# Altium schematic sheet CAN_Transceiver_3V3.SchDoc
size A4; DocumentNumber: 2; SheetNumber: 2; SheetTotal: 11
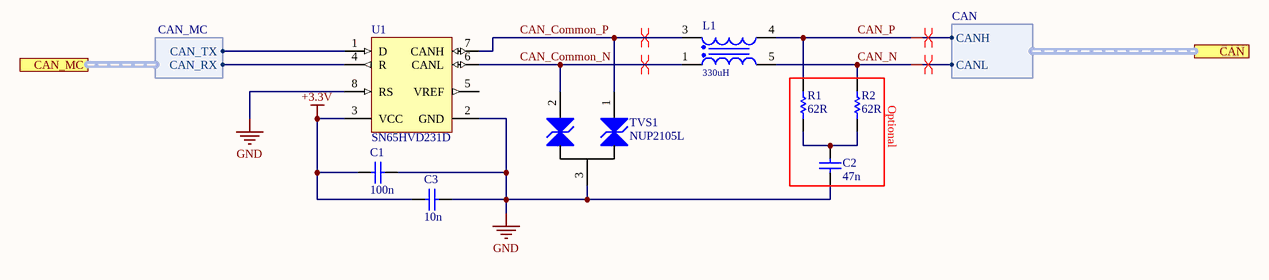
[diagram p0: CAN_Transceiver_3V3.SchDoc]

## Parts
C1  100n  [CAPC0603(1608)55_N]
C2  47n  [CAPC0603(1608)55_N]
C3  10n  [CAPC0603(1608)55_N]
L1  330uH  [WE-SL1]
R1  62R  [RESC0603(1608)_N]
R2  62R  [RESC0603(1608)_N]
TVS1  NUP2105L  [_SOT23-3N]
U1  SN65HVD231D  [D0008A_L]

## Ports
CAN (harness CAN), CAN_MC (harness CAN_MC)

## Harnesses
CAN_MC: CAN_RX, CAN_TX
CAN: CANH, CANL

## Nets
+3.3V: C1.1 C3.1 U1.3(VCC)
GND: C1.2 C2.1 C3.2 TVS1.3(A3) U1.2(GND) U1.8(RS)
CAN_Common_N: L1.1 TVS1.2(A2) U1.6(CANL)
CAN_Common_P: L1.3 TVS1.1(A1) U1.7(CANH)
CAN_N: L1.5 R2.2 ; port CAN.CANL
CAN_P: L1.4 R1.2 ; port CAN.CANH
NetC2_2: C2.2 R1.1 R2.1
NetU1_1: U1.1(D) ; port CAN_MC.CAN_TX
NetU1_4: U1.4(R) ; port CAN_MC.CAN_RX

Not connected (* = marked no-connect by the designer): U1 5(VREF)

## Layout directives
differential pair: CAN_Common_N, CAN_Common_P, CAN_N, CAN_P

## Notes on the sheet
- (near R2) Optional

## Library data of the parts
C1 = Cap 100n: Keramikvielschichtkondensator, SMD, Baureihe MC, ± 10%; Manufacturer: TDK; Voltage Rating: 50V; OC_MOUSER: CGA3E2X7R1H104K080AA; Value: 100n; PackageReference: 0603; Tolerance: ± 10%
C2 = Cap 47n: Keramikvielschichtkondensator, SMD, Baureihe MC, ± 10%; Manufacturer: TDK; Voltage Rating: 50V; OC_MOUSER: CGA3E2X7R1H473K080AA; Value: 47n; PackageReference: 0603; Tolerance: ± 10%
C3 = Cap 10n: Keramikvielschichtkondensator, SMD, Baureihe MC, ± 10%; Manufacturer: TDK; Voltage Rating: 50V; OC_MOUSER: CGA3E2X7R1H103K080AA; Value: 10n; PackageReference: 0603; Tolerance: ± 10%
L1 = 744212331: WE-SL1 SMT Common Mode Line Filter, 330uH, 300mA, 80V; Manufacturer: Wurth Elektronik; Impedance max.: 2000Ohm; Insulation Test Voltage: 250VAC; Winding Style: sectional; ComponentLink1Description: Manufacturer; ComponentLink1URL: http://www.we-online.de; ComponentLink2Description: Datasheet; ComponentLink2URL: https://www.we-online.com/catalog/datasheet/744212331.pdf; Published Date: April 2020; Rated Current: 300mA; Rated Voltage: 80V; Inductance: 330uH; Operating Temperature: -40 to +105degC; Mounting Technology: SMT; Packaging: Tape and Reel; Manufacturer Part Number: 744212331
R1 R2 = Res 62R: Chipwiderstand, SMD, Baureihe MC, 1%; Manufacturer: Multicomp; Power: 100mW; PackageReference: 0603; Value: 62R; OC_FARNELL: 9331433
TVS1 = NUP2105L: Dual Bidirectional Voltage Suppressor 350W Peak
U1 = CMP-0315-00079-2: 3.3V CAN Transceiver with Sleep Mode, 17 mA, 3.3 V, -40 to 85 degC, 8-pin SOIC (D), Green (RoHS & no Sb/Br); Manufacturer: Texas Instruments; Drivers Per Package: 1; Rating: Catalog; Transient Pulse Protection(V): -25 to 25; Supply Voltage(s)(V): 3.3; ICC(Max)(mA): 17; Features: Bus Wake Up; Footprint: PCA82C250; ComponentLink1URL: http://www.ti.com/general/docs/lit/getliterature.tsp?genericPartNumber=SN65HVD231&fileType=pdf; PackageVersion: revM, Jun-2011; SubFamily: CAN; PartNumber: SN65HVD231D; DatasheetVersion: SLOS346K; Isolated: No; PackageDescription: 8-Pin Plastic Small Outline Integrated Circuit, 4.9 x 3.9 mm, Pitch 1.27 mm Pitch; Low Power Mode: Sleep; Code_JEDEC: MS-012AA; ComponentLink1Description: Datasheet; PackageReference: D0008A; Eco-Plan: Green (RoHS & no Sb/Br); Mounting Technology: Surface Mount; Receivers Per Package: 1